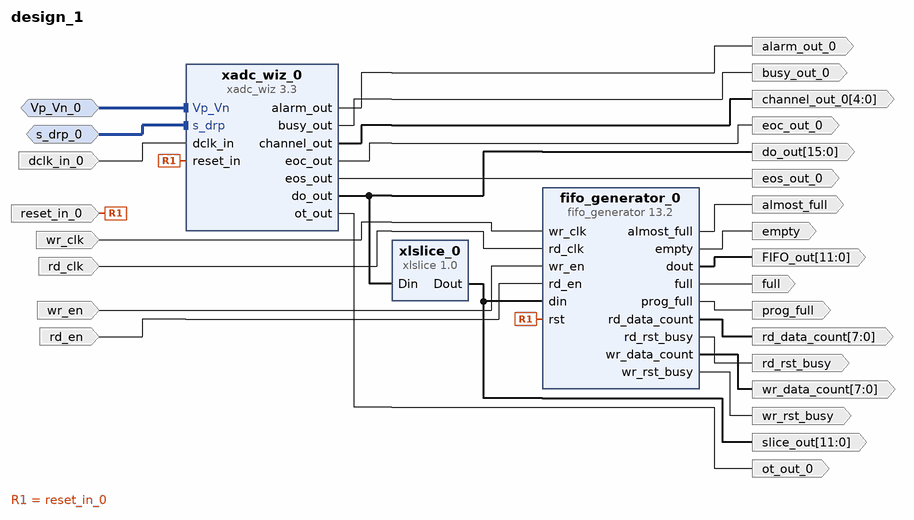
[diagram p0: block diagram of the top level]
# Vivado block design design_1, xc7k70tfbv676-1, Vivado 2017.4
create_bd_design design_1

create_bd_intf_port -mode Slave -vlnv xilinx.com:interface:diff_analog_io_rtl:1.0 Vp_Vn_0
create_bd_intf_port -mode Slave -vlnv xilinx.com:interface:drp_rtl:1.0 s_drp_0
create_bd_port -dir O alarm_out_0
create_bd_port -dir O busy_out_0
create_bd_port -dir O -from 4 -to 0 channel_out_0
create_bd_port -dir I -type clk dclk_in_0
create_bd_port -dir O eoc_out_0
create_bd_port -dir O eos_out_0
create_bd_port -dir O ot_out_0
create_bd_port -dir I -type rst reset_in_0
set_property -dict {CONFIG.POLARITY ACTIVE_HIGH} [get_bd_ports reset_in_0]
create_bd_port -dir O -from 15 -to 0 do_out
create_bd_port -dir O -from 11 -to 0 slice_out
create_bd_port -dir I -type clk wr_clk
set_property -dict {CONFIG.FREQ_HZ 100000000} [get_bd_ports wr_clk]
create_bd_port -dir I -type clk rd_clk
set_property -dict {CONFIG.FREQ_HZ 100000000} [get_bd_ports rd_clk]
create_bd_port -dir O wr_rst_busy
create_bd_port -dir O rd_rst_busy
create_bd_port -dir I wr_en
create_bd_port -dir O full
create_bd_port -dir O almost_full
create_bd_port -dir I rd_en
create_bd_port -dir O empty
create_bd_port -dir O -from 11 -to 0 FIFO_out
create_bd_port -dir O prog_full
create_bd_port -dir O -from 7 -to 0 rd_data_count
create_bd_port -dir O -from 7 -to 0 wr_data_count

create_bd_cell -type ip -vlnv xilinx.com:ip:xadc_wiz:3.3 xadc_wiz_0
set_property -dict [list \
  CONFIG.INTERFACE_SELECTION ENABLE_DRP \
  CONFIG.SIM_FILE_SEL Default \
  CONFIG.SIM_FILE_NAME design \
  CONFIG.WAVEFORM_TYPE TRIANGLE \
  CONFIG.STIMULUS_FREQ 13 \
  CONFIG.DCLK_FREQUENCY 52 \
  CONFIG.ADC_CONVERSION_RATE 1000 \
  CONFIG.ENABLE_RESET true \
  CONFIG.USER_TEMP_ALARM false \
  CONFIG.VCCINT_ALARM false \
  CONFIG.VCCAUX_ALARM false \
  CONFIG.TEMPERATURE_ALARM_OT_TRIGGER 100.0 \
  CONFIG.SINGLE_CHANNEL_SELECTION VP_VN \
  CONFIG.SINGLE_CHANNEL_ENABLE_CALIBRATION true \
] [get_bd_cells xadc_wiz_0]
create_bd_cell -type ip -vlnv xilinx.com:ip:xlslice:1.0 xlslice_0
set_property -dict {CONFIG.DIN_TO 4 CONFIG.DIN_FROM 15 CONFIG.DIN_WIDTH 16 CONFIG.DOUT_WIDTH 12} [get_bd_cells xlslice_0]
create_bd_cell -type ip -vlnv xilinx.com:ip:fifo_generator:13.2 fifo_generator_0
set_property -dict [list \
  CONFIG.Fifo_Implementation Independent_Clocks_Block_RAM \
  CONFIG.Input_Data_Width 12 \
  CONFIG.Input_Depth 256 \
  CONFIG.Output_Data_Width 12 \
  CONFIG.Full_Flags_Reset_Value 1 \
  CONFIG.Almost_Full_Flag true \
  CONFIG.Write_Data_Count true \
  CONFIG.Write_Data_Count_Width 8 \
  CONFIG.Read_Data_Count true \
  CONFIG.Read_Data_Count_Width 8 \
  CONFIG.Programmable_Full_Type Single_Programmable_Full_Threshold_Constant \
  CONFIG.Full_Threshold_Assert_Value 200 \
  CONFIG.Enable_Safety_Circuit true \
] [get_bd_cells fifo_generator_0]

# ---- connections ----

connect_bd_intf_net -intf_net Vp_Vn_0_1 [get_bd_intf_ports Vp_Vn_0] [get_bd_intf_pins xadc_wiz_0/Vp_Vn]
connect_bd_intf_net -intf_net s_drp_0_1 [get_bd_intf_ports s_drp_0] [get_bd_intf_pins xadc_wiz_0/s_drp]
connect_bd_net [get_bd_pins xadc_wiz_0/alarm_out] [get_bd_ports alarm_out_0]
connect_bd_net [get_bd_pins xadc_wiz_0/busy_out] [get_bd_ports busy_out_0]
connect_bd_net [get_bd_pins xadc_wiz_0/channel_out] [get_bd_ports channel_out_0]
connect_bd_net -net dclk_in_0_1 [get_bd_ports dclk_in_0] [get_bd_pins xadc_wiz_0/dclk_in]
connect_bd_net [get_bd_pins xadc_wiz_0/eoc_out] [get_bd_ports eoc_out_0]
connect_bd_net [get_bd_pins xadc_wiz_0/eos_out] [get_bd_ports eos_out_0]
connect_bd_net [get_bd_pins xadc_wiz_0/ot_out] [get_bd_ports ot_out_0]
connect_bd_net -net reset_in_0_1 [get_bd_ports reset_in_0] [get_bd_pins xadc_wiz_0/reset_in] [get_bd_pins fifo_generator_0/rst]
connect_bd_net [get_bd_pins xadc_wiz_0/do_out] [get_bd_ports do_out] [get_bd_pins xlslice_0/Din]
connect_bd_net [get_bd_pins xlslice_0/Dout] [get_bd_ports slice_out] [get_bd_pins fifo_generator_0/din]
connect_bd_net [get_bd_ports wr_clk] [get_bd_pins fifo_generator_0/wr_clk]
connect_bd_net [get_bd_ports rd_clk] [get_bd_pins fifo_generator_0/rd_clk]
connect_bd_net [get_bd_pins fifo_generator_0/wr_rst_busy] [get_bd_ports wr_rst_busy]
connect_bd_net [get_bd_pins fifo_generator_0/rd_rst_busy] [get_bd_ports rd_rst_busy]
connect_bd_net [get_bd_ports wr_en] [get_bd_pins fifo_generator_0/wr_en]
connect_bd_net [get_bd_pins fifo_generator_0/full] [get_bd_ports full]
connect_bd_net [get_bd_pins fifo_generator_0/almost_full] [get_bd_ports almost_full]
connect_bd_net [get_bd_ports rd_en] [get_bd_pins fifo_generator_0/rd_en]
connect_bd_net [get_bd_pins fifo_generator_0/empty] [get_bd_ports empty]
connect_bd_net [get_bd_pins fifo_generator_0/dout] [get_bd_ports FIFO_out]
connect_bd_net [get_bd_pins fifo_generator_0/prog_full] [get_bd_ports prog_full]
connect_bd_net [get_bd_pins fifo_generator_0/rd_data_count] [get_bd_ports rd_data_count]
connect_bd_net [get_bd_pins fifo_generator_0/wr_data_count] [get_bd_ports wr_data_count]

validate_bd_design
save_bd_design
